# Altium schematic sheet MicroController.SchDoc
size 254 x 228 mm; SheetNumber: 3; SheetTotal: 11
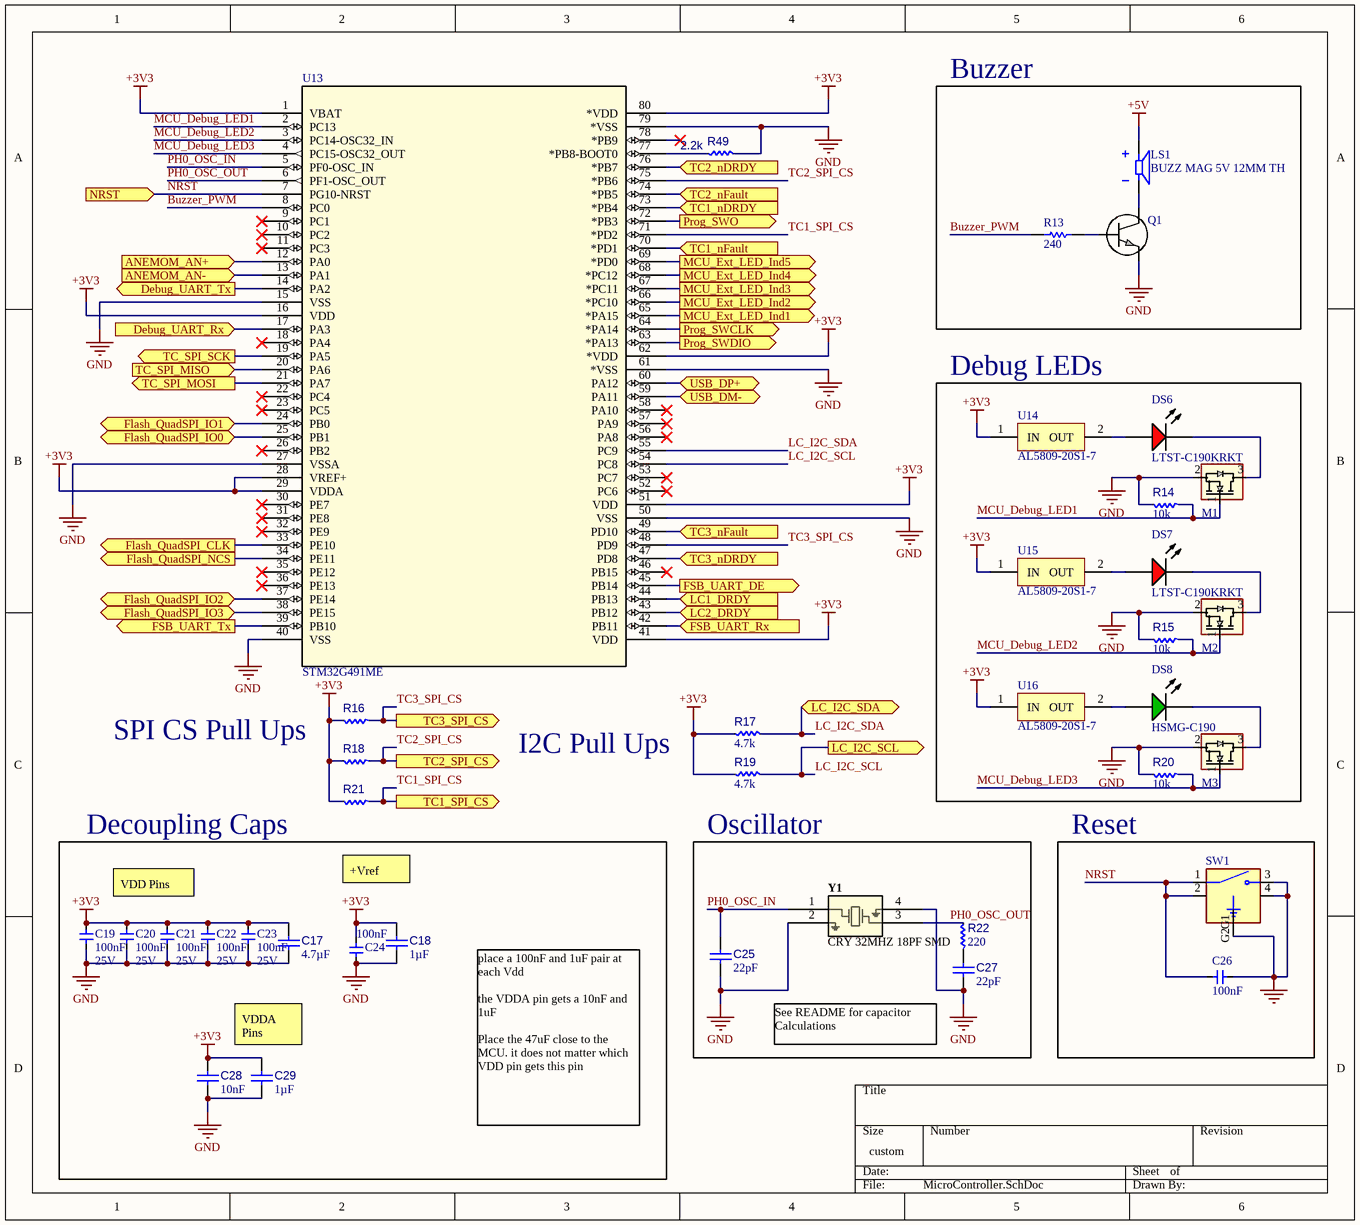
[diagram p0: MicroController.SchDoc]

## Parts
C17  value 4.7µF  [Copy of CAPC0603(1608)100_L]  (hidden comment: CAP CER 4.7µF +/-20% 10V 0603)
C18  value 1µF  [CAPC0402(1005)60_L]  (hidden comment: Capacitor 1µF +/-20% 10V 0402)
C19  value 100nF  Voltage - Rated: 25V  [0.1uF-FP-CGA3E-0_3-0_1-IPC_A]  (hidden comment: CAP CER 0.1UF 25V 0603)
C20  value 100nF  Voltage - Rated: 25V  [0.1uF-FP-CGA3E-0_3-0_1-IPC_A]  (hidden comment: CAP CER 0.1UF 25V 0603)
C21  value 100nF  Voltage - Rated: 25V  [0.1uF-FP-CGA3E-0_3-0_1-IPC_A]  (hidden comment: CAP CER 0.1UF 25V 0603)
C22  value 100nF  Voltage - Rated: 25V  [0.1uF-FP-CGA3E-0_3-0_1-IPC_A]  (hidden comment: CAP CER 0.1UF 25V 0603)
C23  value 100nF  Voltage - Rated: 25V  [0.1uF-FP-CGA3E-0_3-0_1-IPC_A]  (hidden comment: CAP CER 0.1UF 25V 0603)
C24  value 100nF  [0.1uF-FP-CGA3E-0_3-0_1-IPC_A]  (hidden comment: CAP CER 0.1UF 25V 0603)
C25  value 22pF  [CAP_0603_LD]  (hidden comment: CAP CER 22pF 5% 50V C0G 0603)
C26  value 100nF  [0.1uF-FP-CGA3E-0_3-0_1-IPC_A]  (hidden comment: CAP CER 0.1UF 25V 0603)
C27  value 22pF  [CAP_0603_LD]  (hidden comment: CAP CER 22pF 5% 50V C0G 0603)
C28  value 10nF  [CAP_0603]  (hidden comment: CAP CER 10nF 50V 10% 0603)
C29  value 1µF  [CAPC0402(1005)60_L]  (hidden comment: Capacitor 1µF +/-20% 10V 0402)
DS6  LTST-C190KRKT  [LTST-C191KRKT_V]
DS7  LTST-C190KRKT  [LTST-C191KRKT_V]
DS8  HSMG-C190  [AVAG-HSMX-C190_V]
LS1  BUZZ MAG 5V 12MM TH  [CMI-1210-5-95T-Footprint-1]
M1  MOS NMOS 30V 5.6A SOT-23  [PJA3404_R1_00001-Footprint-1]  (value not drawn)
M2  MOS NMOS 30V 5.6A SOT-23  [PJA3404_R1_00001-Footprint-1]  (value not drawn)
M3  MOS NMOS 30V 5.6A SOT-23  [PJA3404_R1_00001-Footprint-1]  (value not drawn)
Q1  NPN 350mW 40V 200mA  [MMBT3904-TP-Footprint-1]  (value not drawn)
R13  value 240  [RESC1005X40X25ML05T05]  (hidden comment: ERJ-2GEJ241x)
R14  value 10k  [RESC2013X50X35ML15T15]  (hidden comment: Resistor 10k +/-1% 0805 125 mW)
R15  value 10k  [RESC2013X50X35ML15T15]  (hidden comment: Resistor 10k +/-1% 0805 125 mW)
R16  CRGCQ0603F2K2  [FP-CRGCQ0603-IPC_A]  (value not drawn)
R17  value 4.7k  [RESC2013X70X40ML20T20]  (hidden comment: Resistor 4k7 +/-1% 0805 125 mW)
R18  CRGCQ0603F2K2  [FP-CRGCQ0603-IPC_A]  (value not drawn)
R19  value 4.7k  [RESC2013X70X40ML20T20]  (hidden comment: Resistor 4k7 +/-1% 0805 125 mW)
R20  value 10k  [RESC2013X50X35ML15T15]  (hidden comment: Resistor 10k +/-1% 0805 125 mW)
R21  CRGCQ0603F2K2  [FP-CRGCQ0603-IPC_A]  (value not drawn)
R22  value 220  [RES_0603_LD]  (hidden comment: RES 220R 5% 100mW 0603)
R49  2.2k  [FP-CRGCQ0603-IPC_A]
SW1  BTN 12V 0.05A PTS526SMG15SMTR2 LFS  [PTS526SMG15SMTR2-Footprint-1]  (value not drawn)
U13  STM32G491ME  [STM32G491ME-Footprint-1]
U14  AL5809-20S1-7  [DIOD-SOD123-A_V]
U15  AL5809-20S1-7  [DIOD-SOD123-A_V]
U16  AL5809-20S1-7  [DIOD-SOD123-A_V]
Y1  CRY 32MHZ 18PF SMD  [ABM8-32.000MHZ-B2-T-Footprint-1]

## Blocks framed on the sheet
Buzzer: LS1 Q1 R13
Debug LEDs: DS6-DS8 M1-M3 R14 R15 R20 U14-U16
Decoupling Caps: C17-C24 C28 C29
Oscillator: C25 C27 R22 Y1
Reset: C26 SW1

## Ports
ANEMOM_AN+ (in, see TopLevel[3B]), ANEMOM_AN- (in, see TopLevel[3B]), Debug_UART_Rx (in, see TopLevel[4A]), Debug_UART_Tx (out, see TopLevel[4A]), Flash_QuadSPI_CLK (out, see TopLevel[3A]), Flash_QuadSPI_IO0 (bidir, see TopLevel[3A]), Flash_QuadSPI_IO1 (bidir, see TopLevel[3A]), Flash_QuadSPI_IO2 (bidir, see TopLevel[3A]), Flash_QuadSPI_IO3 (bidir, see TopLevel[3A]), Flash_QuadSPI_NCS (out, see TopLevel[3A]), FSB_UART_DE (out, see TopLevel[3A]), FSB_UART_Rx (in, see TopLevel[3A]), FSB_UART_Tx (out, see TopLevel[3A]), LC1_DRDY (in, see TopLevel[3A]), LC2_DRDY (in, see TopLevel[3A]), LC_I2C_SCL (out, see TopLevel[3A]), LC_I2C_SDA (bidir, see TopLevel[3A]), MCU_Ext_LED_Ind1 (out, see TopLevel[4B]), MCU_Ext_LED_Ind2 (out, see TopLevel[4B]), MCU_Ext_LED_Ind3 (out, see TopLevel[4B]), MCU_Ext_LED_Ind4 (out, see TopLevel[4B]), MCU_Ext_LED_Ind5 (out, see TopLevel[4B]), NRST (in, see TopLevel[4A]), Prog_SWCLK (out, see TopLevel[4A]), Prog_SWDIO (out, see TopLevel[4A]), Prog_SWO (out, see TopLevel[4A]), TC1_nDRDY (in, see TopLevel[4A]), TC1_nFault (in, see TopLevel[4B]), TC1_SPI_CS (out, see TopLevel[4A]), TC2_nDRDY (in, see TopLevel[4A]), TC2_nFault (in, see TopLevel[4B]), TC2_SPI_CS (out, see TopLevel[4A]), TC3_nDRDY (in, see TopLevel[4A]), TC3_nFault (in, see TopLevel[4B]), TC3_SPI_CS (out, see TopLevel[4A]), TC_SPI_MISO (in, see TopLevel[4A]), TC_SPI_MOSI (out, see TopLevel[4A]), TC_SPI_SCK (out, see TopLevel[4A]), USB_DM- (bidir, see TopLevel[3B]), USB_DP+ (bidir, see TopLevel[3B])

## Nets
+3V3: C17.2 C18.2 C19.2 C20.2 C21.2 C22.2 C23.2 C24.2 C28.2 C29.2 R16.2 R17.1 R18.2 R19.1 R21.2 U13.1(VBAT) U13.16(VDD) U13.28(VREF+) U13.29(VDDA) U13.41(VDD) U13.51(VDD) U13.62(*VDD) U13.80(*VDD) U14.1(IN) U15.1(IN) U16.1(IN)
+5V: LS1.P
GND: C17.1 C18.1 C19.1 C20.1 C21.1 C22.1 C23.1 C24.1 C25.1 C26.1 C27.1 C28.1 C29.1 M1.2 M2.2 M3.2 Q1.2(C) R14.2 R15.2 R20.2 R49.2 SW1.3(NO) SW1.4(NO) SW1.G2(GND) U13.15(VSS) U13.27(VSSA) U13.40(VSS) U13.50(VSS) U13.61(*VSS) U13.79(*VSS) Y1.2 Y1.4
ANEMOM_AN+: U13.12(PA0) ; port ANEMOM_AN+
ANEMOM_AN-: U13.13(PA1) ; port ANEMOM_AN-
Buzzer_PWM: R13.1 U13.8(PC0)
Debug_UART_Rx: U13.17(PA3) ; port Debug_UART_Rx
Debug_UART_Tx: U13.14(PA2) ; port Debug_UART_Tx
Flash_QuadSPI_CLK: U13.33(PE10) ; port Flash_QuadSPI_CLK
Flash_QuadSPI_IO0: U13.25(PB1) ; port Flash_QuadSPI_IO0
Flash_QuadSPI_IO1: U13.24(PB0) ; port Flash_QuadSPI_IO1
Flash_QuadSPI_IO2: U13.37(PE14) ; port Flash_QuadSPI_IO2
Flash_QuadSPI_IO3: U13.38(PE15) ; port Flash_QuadSPI_IO3
Flash_QuadSPI_NCS: U13.34(PE11) ; port Flash_QuadSPI_NCS
FSB_UART_DE: U13.45(PB14) ; port FSB_UART_DE
FSB_UART_Rx: U13.42(PB11) ; port FSB_UART_Rx
FSB_UART_Tx: U13.39(PB10) ; port FSB_UART_Tx
LC1_DRDY: U13.44(PB13) ; port LC1_DRDY
LC2_DRDY: U13.43(PB12) ; port LC2_DRDY
LC_I2C_SCL: R19.2 U13.54(PC8) ; port LC_I2C_SCL
LC_I2C_SDA: R17.2 U13.55(PC9) ; port LC_I2C_SDA
MCU_Debug_LED1: M1.1 R14.1 U13.2(PC13)
MCU_Debug_LED2: M2.1 R15.1 U13.3(PC14-OSC32_IN)
MCU_Debug_LED3: M3.1 R20.1 U13.4(PC15-OSC32_OUT)
MCU_Ext_LED_Ind1: U13.65(*PA15) ; port MCU_Ext_LED_Ind1
MCU_Ext_LED_Ind2: U13.66(*PC10) ; port MCU_Ext_LED_Ind2
MCU_Ext_LED_Ind3: U13.67(*PC11) ; port MCU_Ext_LED_Ind3
MCU_Ext_LED_Ind4: U13.68(*PC12) ; port MCU_Ext_LED_Ind4
MCU_Ext_LED_Ind5: U13.69(*PD0) ; port MCU_Ext_LED_Ind5
NRST: C26.2 SW1.1(COM) SW1.2(COM) U13.7(PG10-NRST) ; port NRST
PH0_OSC_IN: C25.2 U13.5(PF0-OSC_IN) Y1.1
PH0_OSC_OUT: R22.2 U13.6(PF1-OSC_OUT) Y1.3
Prog_SWCLK: U13.64(*PA14) ; port Prog_SWCLK
Prog_SWDIO: U13.63(*PA13) ; port Prog_SWDIO
Prog_SWO: U13.72(*PB3) ; port Prog_SWO
TC1_nDRDY: U13.73(*PB4) ; port TC1_nDRDY
TC1_nFault: U13.70(*PD1) ; port TC1_nFault
TC1_SPI_CS: R21.1 U13.71(*PD2) ; port TC1_SPI_CS
TC2_nDRDY: U13.76(*PB7) ; port TC2_nDRDY
TC2_nFault: U13.74(*PB5) ; port TC2_nFault
TC2_SPI_CS: R18.1 U13.75(*PB6) ; port TC2_SPI_CS
TC3_nDRDY: U13.47(PD8) ; port TC3_nDRDY
TC3_nFault: U13.49(PD10) ; port TC3_nFault
TC3_SPI_CS: R16.1 U13.48(PD9) ; port TC3_SPI_CS
TC_SPI_MISO: U13.20(PA6) ; port TC_SPI_MISO
TC_SPI_MOSI: U13.21(PA7) ; port TC_SPI_MOSI
TC_SPI_SCK: U13.19(PA5) ; port TC_SPI_SCK
USB_DM-: U13.59(PA11) ; port USB_DM-
USB_DP+: U13.60(PA12) ; port USB_DP+
NetC27_2: C27.2 R22.1
NetDS6_1: DS6.1(A) U14.2(OUT)
NetDS6_2: DS6.2(K) M1.3
NetDS7_1: DS7.1(A) U15.2(OUT)
NetDS7_2: DS7.2(K) M2.3
NetDS8_1: DS8.1(A) U16.2(OUT)
NetDS8_2: DS8.2(K) M3.3
NetLS1_N: LS1.N Q1.3(E)
NetQ1_1: Q1.1(B) R13.2
NetR49_1: R49.1 U13.77(*PB8-BOOT0)

Not connected (* = marked no-connect by the designer): SW1 G1(GND); U13 9(PC1)* 10(PC2)* 11(PC3)* 18(PA4)* 22(PC4)* 23(PC5)* 26(PB2)* 30(PE7)* 31(PE8)* 32(PE9)* 35(PE12)* 36(PE13)* 46(PB15)* 52(PC6)* 53(PC7)* 56(PA8)* 57(PA9)* 58(PA10)* 78(*PB9)*

## Notes on the sheet
- SPI CS Pull Ups
- I2C Pull Ups
- VDD Pins
- +Vref
- VDDA Pins
- (near C27) See README for capacitor Calculations
- place a 100nF and 1uF pair at each Vdd
  the VDDA pin gets a 10nF and 1uF
  Place the 47uF close to the MCU. it does not matter which VDD pin gets this pin

## Library data of the parts
C17 = CMP-001-00076-6: CC0603MRX5R6BB475 Chip Capacitor, 4.7µF +/-20%, 10V, 0603, Thickness 1 mm; Tolerance: 20%; Voltage Rating: 10V; Mounting Technology: Surface Mount; Pins: 2; Case/Package: 0603; Min Operating Temperature: -55°C; Max Operating Temperature: 85°C
C18 C29 = CMP-001-00063-4: Chip Capacitor, 1µF +/-20%, 10V, 0402, Thickness 0.6 mm; Tolerance: 10%; Voltage Rating: 10V; Pins: 2; Max Operating Temperature: 85°C; Mounting Technology: SMT; Case/Package: 0402; Min Operating Temperature: -55°C
C19-C24 C26 = CMP-001-00093-3: CGA3E2X7R1E104K080AA CAP CER 0.1UF 25V X7R 0603; Manufacturer: TDK Corporation; Tolerance: 10%; Source: PlumBay_SchLib.SchLib; Thickness (Max): 0.035" (0.90mm); Case/Package: 0603 (1608 Metric); Temperature Coefficient: X7R; Operating Temperature: -55°C ~ 125°C; Mounting Type: Surface Mount, MLCC; ComponentLink1URL: https://product.tdk.com/info/en/catalog/spec/mlccspec_automotive_general_en.pdf; Size / Dimension: 0.063" L x 0.031" W (1.60mm x 0.80mm); Design Item ID: CGA3E2X7R1E104K080AA; Manufacturer Part Number: CGA3E2X7R1E104K080AA; ComponentLink1Description: Datasheet
  C24 C26: Voltage - Rated: 25V
C25 C27 = CMP-001-00123-1: GRM1885C1H220JA01D - 22 pF ±5% 50V Ceramic Capacitor C0G, NP0 0603 (1608 Metric); Insulation Resistance: 10GR; Tolerance (fill in as +-): 10%; Multilayer: Yes; Temperature Characteristics Code: X7R; Temperature Coefficient: 30ppm/°C; RoHS Compliant: Yes; Voltage Rating (DC): 50V; Depth: 0.8mm; Material: Ceramic; Package Style: SMTMeter; Pins: 2; Tolerance: 5%; Construction: Flat; Dielectric: C0G; Voltage Rating: 50V; Width: 0.8mm; Terminal Finish: Nickel; Length: 1.6mm; Voltage: 50V; Reach SVHC Compliant: Yes; Case/Package: 0603; Mounting Technology: Surface Mount; Thickness: 0.035inch; Rated DC Voltage (URdc): 50V; Packaging: Tape and Reel; Lead Free: Lead Free; Series: GRM; Capacitor Type: Ceramic; JESD-609 Code: e3; Radiation Hardening: No; Max Operating Temperature: 125°C; Dielectric Material: Ceramic; Package Quantity: 1; Size: 0.8mm; Case Code (Imperial): 0603; Case Code (Metric): 1608; Height: 0.8mm; Tolerance  (fill in as +-): 10%; Min Operating Temperature: -55°C; Package Shape: Rectangular; Termination: Wraparound
C28 = CMP-001-00185-1: C0603C103K5RACTU - Multilayer Ceramic Capacitors Mlcc - Smd/Smt 50V 0.01Uf X7R 0603 10%; Capacitor Type: Ceramic; Max Operating Temperature: 125°C; Pins: 2; Mounting Technology: Surface Mount; Tolerance: 10%; Voltage Rating: 50V; RoHS Compliant: Yes; Case/Package: 0603; Min Operating Temperature: -55°C
DS6 DS7 = CMP-007-00024-2: LED Uni-Color Red, 62.5 mW, 25 mA, -30 to 85 degC, 2-Pin SMD, RoHS, Tape and Reel; Manufacturer: Lite-On; Power: 75mW; Forward Voltage: 2V; Luminous Intensity: 54mcd; Lens Style: Diffused; Viewing Angle: 130degrees; Forward Current: 20mA; Manufacturer URL: http://www.us.liteon.com/; Case/Package: 0603; Datasheet Version: Rev. F, 05/2013; Package Reference: C191KRKT; Datasheet URL: http://optoelectronics.liteon.com/upload/download/DS-22-99-0151/S_110_LTST-C190KRKT.pdf; Package Description: 2-Pin Surface Mount Device, Body 1.6 x 0.8 mm; Nominal Vf: 2V; Packaging: TapeandReel; RoHS Compliant: True; Pins: 2; Illumination Colour: Red; Colour: Red; Mounting Technology: SM; Package Quantity: 3000; Min Operating Temperature: -55°C; Max Operating Temperature: 85°C
DS8 = CMP-007-00013-2: LED Uni-Color Green, 52 mW, 20 mA, -40 to 85 degC, 2-Pin SMD, RoHS, Tape and Reel; Manufacturer: Avago; Forward Current: 20mA; Viewing Angle: 170degrees; Luminous Intensity: 15mcd; Lens Style: Diffused; Forward Voltage: 2.2V; Power: 52mW; Mounting Technology: SM; RoHS Compliant: True; Packaging: TapeandReel; Illumination Colour: Green; Datasheet URL: http://docs.avagotech.com/docs/AV02-0551EN; Min Operating Temperature: -40°C; Max Operating Temperature: 85°C; Pins: 2; Package Description: 2-Pin Surface Mount Device, Body 1.6 x 0.8 mm, Height 0.9 mm; Nominal Vf: 2.2V; Case/Package: 0603; Manufacturer URL: http://www.avagotech.com/; Datasheet Version: Mar-12; Colour: Green; Package Reference: HSMX-C190; Package Quantity: 4000
LS1 = CMP-00027-00004-1: CMI-1210-5-95T 12 mm, 5 Vdc, 98 dB, Through Hole, Magnetic Audio Indicator Buzzer CMI-1210-5-95T
M1-M3 = CMP-013-00040-2: PJA3404_R1_00001 - Power Field-Effect Transistor, 5.6A I(D), 30V, 0.03ohm, 1-Element, N-Channel, Silicon, Metal-oxide Semiconductor FET; Transistor Application: SWITCHING; Drain-source On Resistance-Max: 30mR; Pulsed Drain Current-Max (IDM): 22A; Package Body Material: Plastic; Operating Mode: ENHANCEMENT MODE; Number of Elements: 1; Drain Current-Max (ID): 5.6A; DS Breakdown Voltage-Min: 30V; Transistor Element Material: SILICON; Polarity/Channel Type: N-CHANNEL; Surface Mount: Yes; Package Shape: Rectangular; Package Style: SMALL OUTLINEMeter; FET Technology: METAL-OXIDE SEMICONDUCTOR; Pins: 3; JESD-30 Code: R-PDSO-G3; Terminal Position: DUAL; RoHS Compliant: Yes; Reach SVHC Compliant: Yes; Terminal Form: Gull Wing
Q1 = CMP-013-00047-1: Transistor, Bipolar, Si, NPN, Amplifier, Small Signal, Vceo 40VDC, IC 200MA, Pd 350MW; Frequency: 300MHz; Mounting Technology: Surface Mount; Case/Package: SOT-23; Min Operating Temperature: -55°C; Pins: 3; Max Operating Temperature: 150°C
R13 = CMP-009-00178-1: Chip Resistor, 240 Ohm, +/- 5%, 100 mW, -55 to 155 degC, 0402 (1005 Metric), RoHS, Tape and Reel; Manufacturer: Panasonic; Power Rating: 100 mW; Case\/Package: 0402; Voltage Rating: 50V; Height: 0.35 mm; ComponentLink2URL: http://industrial.panasonic.com/cdbs/www-data/pdf/RDA0000/AOA0000C84.pdf; Package Quantity: 10000; REACH SVHC: Yes; RoHSCompliant: true; Mounting Technology: Surface Mount; PartNumber: ERJ-2GEJ241x; Source: PC4-SODIMM_V200_RC_A1_20141015.SCHLIB; Tolerance: 5%; Case/Package: 0402; DatasheetVersion: 03/2015; Max Operating Temperature: 155°C; Packaging: Tape and Reel; ComponentLink1Description: Manufacturer URL; Manufacturer Part Number: ERJ-2GEJ241X; ComponentLink2Description: Datasheet; PackageReference: 0402; Design Item ID: CMP-2002-00493-3; Mount: Surface Mount; ComponentLink1URL: http://www.panasonic.com/; Pins: 2; Length: 1 mm; Case Code (Metric): 1005; Radiation Hardening: No; PackageDescription: 2-Pin Surface Mount Device, Body 1 x 0.5 mm; Width: 0.5 mm; Component Type: Standard; Min Operating Temperature: -55°C
R14 R15 R20 = CMP-009-00018-9: Chip Resistor, 10 KOhm, +/- 1%, 125 mW, -55 to 155 degC, 0805 (2012 Metric); Power: 125mW; Voltage Rating: 150V; Tolerance: 1%; RoHS Compliant: True; Pins: 2; Case/Package: 0805; Mounting Technology: SM; Min Operating Temperature: -55°C; Max Operating Temperature: 155°C
R16 R18 R21 R49 = CMP-009-00324-1: Fixed Resistor, Metal Glaze/thick Film, 0.1W, 2200ohm, 75V, 1% +/-Tol, 100ppm/Cel, Surface Mount, 0603; RoHS Compliant: Yes; Pins: 2
R17 R19 = CMP-009-00032-9: Chip Resistor, 4.7 KOhm, +/- 1%, 0.125 W, -55 to 155 degC, 0805 (2012 Metric); Power: 125mW; Voltage Rating: 150V; Min Operating Temperature: -55°C; Case/Package: 0805; Pins: 2; RoHS Compliant: True; Max Operating Temperature: 155°C; Tolerance: 1%; Mounting Technology: SM
R22 = CMP-009-00231-3: CRGCQ0603J220R - Fixed Resistor, Metal Glaze/thick Film, 0.1W, 220ohm, 75V, 5% +/-Tol, 100ppm/Cel, Surface Mount, 0603; Max Operating Temperature: 155°C; Reach SVHC Compliant: Yes; Mounting Technology: Surface Mount; RoHS Compliant: Yes; Case/Package: 0603; Min Operating Temperature: -55°C; Pins: 2; Resistor Type: FIXED RESISTOR
SW1 = CMP-00028-00009-2: Switch Tactile N.O. SPST Round Button Gull Wing 0.05A 12VDC 500000Cycles 1.57N SMD T/R PTS526SMG15SMTR2 LFS
U13 = CMP-020-00028-1: MCU 32-Bit ARM Cortex-M4 RISC 512kByte Flash 1.71V to 3.6V 80-Pin LQFP Tray
U14-U16 = CMP-00024-00007-1: Led Driver, Cc/Linear, -40 To 125Deg C Rohs Compliant: Yes; Min Input Voltage: 2.5V; Max Output current: 21mA; Max Supply Voltage: 60V; Mounting Technology: Surface Mount; Max Operating Temperature: 125°C; Pins: 2; Min Operating Temperature: -40°C; Case/Package: SOD
Y1 = CMP-003-00039-2: Crystal 32MHz ±20ppm (Tol) ±50ppm (Stability) 18pF FUND 40Ohm 4-Pin Ultra Mini-CSMD T/R; ESR: 40; Max Operating Temperature: 70°C; Load Capacitance: 18pF; Mounting Technology: Surface Mount; Min Operating Temperature: -20°C; Pins: 4; Case/Package: SMD/SMT; Frequency: 32MHz